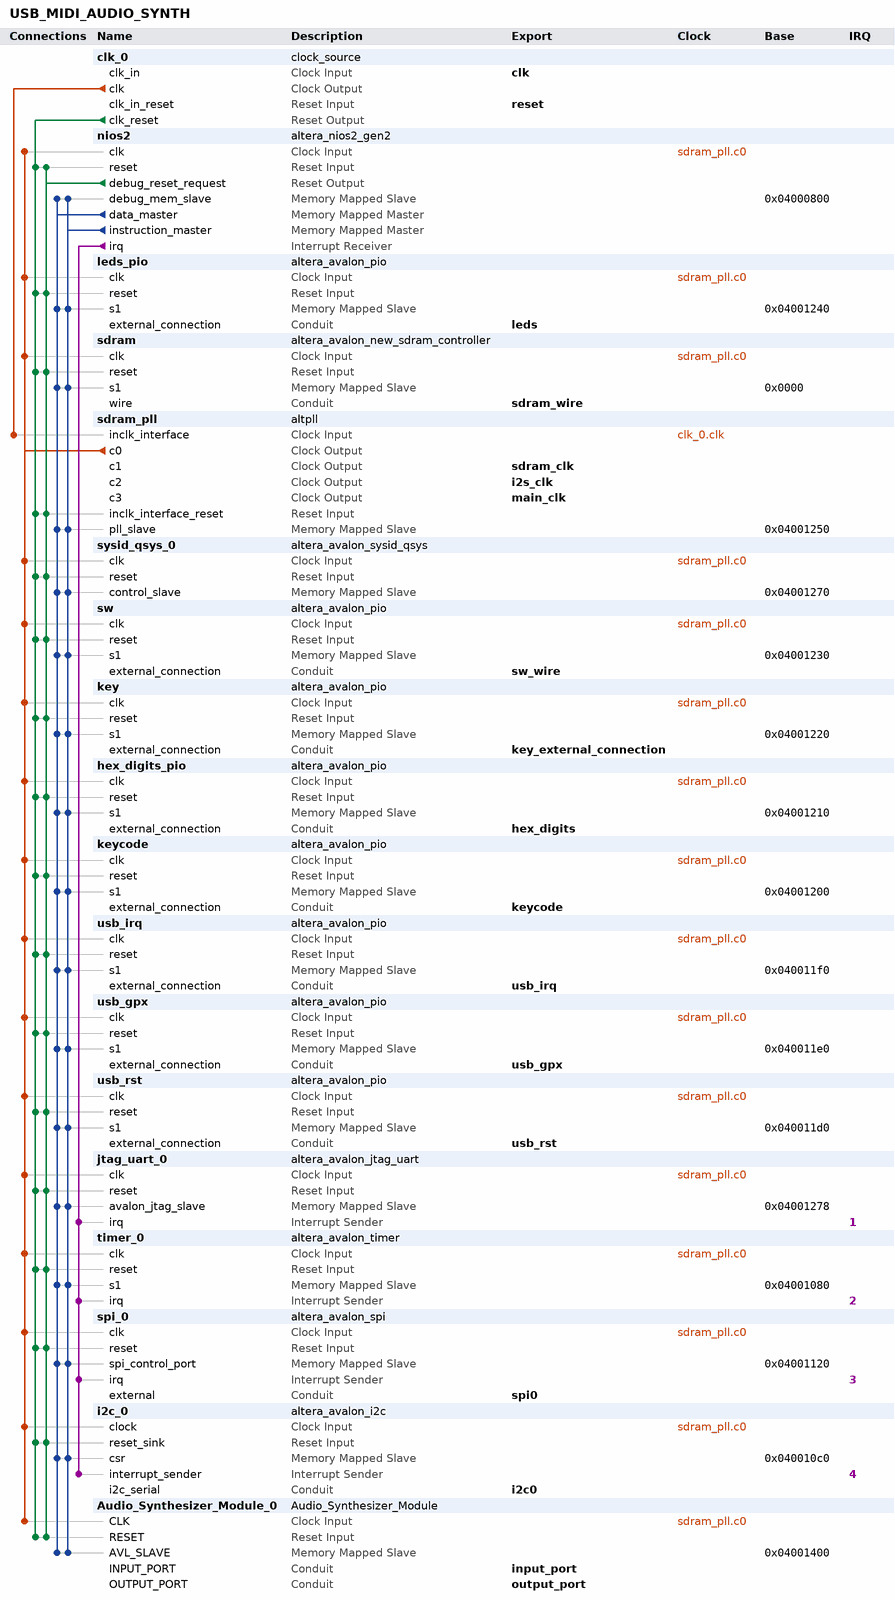
[diagram p0: system contents]
# Platform Designer (Qsys) system USB_MIDI_AUDIO_SYNTH, MAX 10 10M50DAF484C7G
# Parameters at their usual value, and those the tool derives, are not listed.
package require -exact qsys 18.1
create_system USB_MIDI_AUDIO_SYNTH
set_project_property DEVICE_FAMILY {MAX 10}
set_project_property DEVICE 10M50DAF484C7G

add_instance clk_0 clock_source 18.1
set_instance_parameter_value clk_0 clockFrequency 50000000

add_instance nios2 altera_nios2_gen2 18.1
set_instance_parameter_value nios2 dcache_size 2048
set_instance_parameter_value nios2 exceptionSlave sdram.s1
set_instance_parameter_value nios2 icache_size 4096
set_instance_parameter_value nios2 impl Tiny
set_instance_parameter_value nios2 resetSlave sdram.s1

add_instance leds_pio altera_avalon_pio 18.1
set_instance_parameter_value leds_pio direction Output
set_instance_parameter_value leds_pio width 14

add_instance sdram altera_avalon_new_sdram_controller 18.1
set_instance_parameter_value sdram TAC 5.4
set_instance_parameter_value sdram TRCD 20.0
set_instance_parameter_value sdram TRP 20.0
set_instance_parameter_value sdram casLatency 3
set_instance_parameter_value sdram columnWidth 10
set_instance_parameter_value sdram dataWidth 16
set_instance_parameter_value sdram generateSimulationModel false
set_instance_parameter_value sdram model single_Micron_MT48LC4M32B2_7_chip
set_instance_parameter_value sdram numberOfBanks 4
set_instance_parameter_value sdram numberOfChipSelects 1
set_instance_parameter_value sdram powerUpDelay 200.0
set_instance_parameter_value sdram refreshPeriod 15.625
set_instance_parameter_value sdram rowWidth 13

add_instance sdram_pll altpll 18.1
set_instance_parameter_value sdram_pll CLK0_DIVIDE_BY 1
set_instance_parameter_value sdram_pll CLK0_MULTIPLY_BY 2
set_instance_parameter_value sdram_pll CLK1_DIVIDE_BY 1
set_instance_parameter_value sdram_pll CLK1_DUTY_CYCLE 50
set_instance_parameter_value sdram_pll CLK1_MULTIPLY_BY 2
set_instance_parameter_value sdram_pll CLK1_PHASE_SHIFT -1000
set_instance_parameter_value sdram_pll CLK2_DIVIDE_BY 15625
set_instance_parameter_value sdram_pll CLK2_DUTY_CYCLE 50
set_instance_parameter_value sdram_pll CLK2_MULTIPLY_BY 3528
set_instance_parameter_value sdram_pll CLK2_PHASE_SHIFT 0
set_instance_parameter_value sdram_pll CLK3_DIVIDE_BY 1
set_instance_parameter_value sdram_pll CLK3_DUTY_CYCLE 50
set_instance_parameter_value sdram_pll CLK3_MULTIPLY_BY 2
set_instance_parameter_value sdram_pll CLK3_PHASE_SHIFT 0
set_instance_parameter_value sdram_pll INCLK0_INPUT_FREQUENCY 20000
set_instance_parameter_value sdram_pll PORT_ARESET PORT_UNUSED
set_instance_parameter_value sdram_pll PORT_LOCKED PORT_UNUSED
set_instance_parameter_value sdram_pll PORT_clk1 PORT_USED
set_instance_parameter_value sdram_pll PORT_clk2 PORT_USED
set_instance_parameter_value sdram_pll PORT_clk3 PORT_USED

add_instance sysid_qsys_0 altera_avalon_sysid_qsys 18.1
set_instance_parameter_value sysid_qsys_0 id 0

add_instance sw altera_avalon_pio 18.1
set_instance_parameter_value sw direction Input
set_instance_parameter_value sw width 10

add_instance key altera_avalon_pio 18.1
set_instance_parameter_value key direction Input
set_instance_parameter_value key width 4

add_instance hex_digits_pio altera_avalon_pio 18.1
set_instance_parameter_value hex_digits_pio direction Output
set_instance_parameter_value hex_digits_pio width 16

add_instance keycode altera_avalon_pio 18.1
set_instance_parameter_value keycode direction Output
set_instance_parameter_value keycode width 8

add_instance usb_irq altera_avalon_pio 18.1
set_instance_parameter_value usb_irq direction Input
set_instance_parameter_value usb_irq width 1

add_instance usb_gpx altera_avalon_pio 18.1
set_instance_parameter_value usb_gpx direction Input
set_instance_parameter_value usb_gpx width 1

add_instance usb_rst altera_avalon_pio 18.1
set_instance_parameter_value usb_rst direction Output
set_instance_parameter_value usb_rst width 1

add_instance jtag_uart_0 altera_avalon_jtag_uart 18.1
set_instance_parameter_value jtag_uart_0 simInteractiveOptions NO_INTERACTIVE_WINDOWS

add_instance timer_0 altera_avalon_timer 18.1
set_instance_parameter_value timer_0 counterSize 64
set_instance_parameter_value timer_0 period 1
set_instance_parameter_value timer_0 periodUnits MSEC

add_instance spi_0 altera_avalon_spi 18.1
set_instance_parameter_value spi_0 clockPolarity 0
set_instance_parameter_value spi_0 dataWidth 8
set_instance_parameter_value spi_0 masterSPI true
set_instance_parameter_value spi_0 numberOfSlaves 1
set_instance_parameter_value spi_0 targetClockRate 2500000

add_instance i2c_0 altera_avalon_i2c 18.1
set_instance_parameter_value i2c_0 FIFO_DEPTH 4

add_instance Audio_Synthesizer_Module_0 Audio_Synthesizer_Module 1.0

# connections
add_connection clk_0.clk sdram_pll.inclk_interface clock
add_connection sdram_pll.c0 Audio_Synthesizer_Module_0.CLK clock
add_connection sdram_pll.c0 hex_digits_pio.clk clock
add_connection sdram_pll.c0 i2c_0.clock clock
add_connection sdram_pll.c0 jtag_uart_0.clk clock
add_connection sdram_pll.c0 key.clk clock
add_connection sdram_pll.c0 keycode.clk clock
add_connection sdram_pll.c0 leds_pio.clk clock
add_connection sdram_pll.c0 nios2.clk clock
add_connection sdram_pll.c0 sdram.clk clock
add_connection sdram_pll.c0 spi_0.clk clock
add_connection sdram_pll.c0 sw.clk clock
add_connection sdram_pll.c0 sysid_qsys_0.clk clock
add_connection sdram_pll.c0 timer_0.clk clock
add_connection sdram_pll.c0 usb_gpx.clk clock
add_connection sdram_pll.c0 usb_irq.clk clock
add_connection sdram_pll.c0 usb_rst.clk clock
add_connection clk_0.clk_reset Audio_Synthesizer_Module_0.RESET reset
add_connection clk_0.clk_reset hex_digits_pio.reset reset
add_connection clk_0.clk_reset i2c_0.reset_sink reset
add_connection clk_0.clk_reset jtag_uart_0.reset reset
add_connection clk_0.clk_reset key.reset reset
add_connection clk_0.clk_reset keycode.reset reset
add_connection clk_0.clk_reset leds_pio.reset reset
add_connection clk_0.clk_reset nios2.reset reset
add_connection clk_0.clk_reset sdram.reset reset
add_connection clk_0.clk_reset sdram_pll.inclk_interface_reset reset
add_connection clk_0.clk_reset spi_0.reset reset
add_connection clk_0.clk_reset sw.reset reset
add_connection clk_0.clk_reset sysid_qsys_0.reset reset
add_connection clk_0.clk_reset timer_0.reset reset
add_connection clk_0.clk_reset usb_gpx.reset reset
add_connection clk_0.clk_reset usb_irq.reset reset
add_connection clk_0.clk_reset usb_rst.reset reset
add_connection nios2.debug_reset_request Audio_Synthesizer_Module_0.RESET reset
add_connection nios2.debug_reset_request hex_digits_pio.reset reset
add_connection nios2.debug_reset_request i2c_0.reset_sink reset
add_connection nios2.debug_reset_request jtag_uart_0.reset reset
add_connection nios2.debug_reset_request key.reset reset
add_connection nios2.debug_reset_request keycode.reset reset
add_connection nios2.debug_reset_request leds_pio.reset reset
add_connection nios2.debug_reset_request nios2.reset reset
add_connection nios2.debug_reset_request sdram.reset reset
add_connection nios2.debug_reset_request sdram_pll.inclk_interface_reset reset
add_connection nios2.debug_reset_request spi_0.reset reset
add_connection nios2.debug_reset_request sw.reset reset
add_connection nios2.debug_reset_request sysid_qsys_0.reset reset
add_connection nios2.debug_reset_request timer_0.reset reset
add_connection nios2.debug_reset_request usb_gpx.reset reset
add_connection nios2.debug_reset_request usb_irq.reset reset
add_connection nios2.debug_reset_request usb_rst.reset reset
add_connection nios2.data_master Audio_Synthesizer_Module_0.AVL_SLAVE avalon
set_connection_parameter_value nios2.data_master/Audio_Synthesizer_Module_0.AVL_SLAVE baseAddress 0x04001400
add_connection nios2.data_master hex_digits_pio.s1 avalon
set_connection_parameter_value nios2.data_master/hex_digits_pio.s1 baseAddress 0x04001210
add_connection nios2.data_master i2c_0.csr avalon
set_connection_parameter_value nios2.data_master/i2c_0.csr baseAddress 0x040010c0
add_connection nios2.data_master jtag_uart_0.avalon_jtag_slave avalon
set_connection_parameter_value nios2.data_master/jtag_uart_0.avalon_jtag_slave baseAddress 0x04001278
add_connection nios2.data_master key.s1 avalon
set_connection_parameter_value nios2.data_master/key.s1 baseAddress 0x04001220
add_connection nios2.data_master keycode.s1 avalon
set_connection_parameter_value nios2.data_master/keycode.s1 baseAddress 0x04001200
add_connection nios2.data_master leds_pio.s1 avalon
set_connection_parameter_value nios2.data_master/leds_pio.s1 baseAddress 0x04001240
add_connection nios2.data_master nios2.debug_mem_slave avalon
set_connection_parameter_value nios2.data_master/nios2.debug_mem_slave baseAddress 0x04000800
add_connection nios2.data_master sdram.s1 avalon
set_connection_parameter_value nios2.data_master/sdram.s1 baseAddress 0x0000
add_connection nios2.data_master sdram_pll.pll_slave avalon
set_connection_parameter_value nios2.data_master/sdram_pll.pll_slave baseAddress 0x04001250
add_connection nios2.data_master spi_0.spi_control_port avalon
set_connection_parameter_value nios2.data_master/spi_0.spi_control_port baseAddress 0x04001120
add_connection nios2.data_master sw.s1 avalon
set_connection_parameter_value nios2.data_master/sw.s1 baseAddress 0x04001230
add_connection nios2.data_master sysid_qsys_0.control_slave avalon
set_connection_parameter_value nios2.data_master/sysid_qsys_0.control_slave baseAddress 0x04001270
add_connection nios2.data_master timer_0.s1 avalon
set_connection_parameter_value nios2.data_master/timer_0.s1 baseAddress 0x04001080
add_connection nios2.data_master usb_gpx.s1 avalon
set_connection_parameter_value nios2.data_master/usb_gpx.s1 baseAddress 0x040011e0
add_connection nios2.data_master usb_irq.s1 avalon
set_connection_parameter_value nios2.data_master/usb_irq.s1 baseAddress 0x040011f0
add_connection nios2.data_master usb_rst.s1 avalon
set_connection_parameter_value nios2.data_master/usb_rst.s1 baseAddress 0x040011d0
add_connection nios2.instruction_master Audio_Synthesizer_Module_0.AVL_SLAVE avalon
set_connection_parameter_value nios2.instruction_master/Audio_Synthesizer_Module_0.AVL_SLAVE baseAddress 0x04001400
add_connection nios2.instruction_master hex_digits_pio.s1 avalon
set_connection_parameter_value nios2.instruction_master/hex_digits_pio.s1 baseAddress 0x04001210
add_connection nios2.instruction_master i2c_0.csr avalon
set_connection_parameter_value nios2.instruction_master/i2c_0.csr baseAddress 0x040010c0
add_connection nios2.instruction_master jtag_uart_0.avalon_jtag_slave avalon
set_connection_parameter_value nios2.instruction_master/jtag_uart_0.avalon_jtag_slave baseAddress 0x04001278
add_connection nios2.instruction_master key.s1 avalon
set_connection_parameter_value nios2.instruction_master/key.s1 baseAddress 0x04001220
add_connection nios2.instruction_master keycode.s1 avalon
set_connection_parameter_value nios2.instruction_master/keycode.s1 baseAddress 0x04001200
add_connection nios2.instruction_master leds_pio.s1 avalon
set_connection_parameter_value nios2.instruction_master/leds_pio.s1 baseAddress 0x04001240
add_connection nios2.instruction_master nios2.debug_mem_slave avalon
set_connection_parameter_value nios2.instruction_master/nios2.debug_mem_slave baseAddress 0x04000800
add_connection nios2.instruction_master sdram.s1 avalon
set_connection_parameter_value nios2.instruction_master/sdram.s1 baseAddress 0x0000
add_connection nios2.instruction_master sdram_pll.pll_slave avalon
set_connection_parameter_value nios2.instruction_master/sdram_pll.pll_slave baseAddress 0x04001250
add_connection nios2.instruction_master spi_0.spi_control_port avalon
set_connection_parameter_value nios2.instruction_master/spi_0.spi_control_port baseAddress 0x04001120
add_connection nios2.instruction_master sw.s1 avalon
set_connection_parameter_value nios2.instruction_master/sw.s1 baseAddress 0x04001230
add_connection nios2.instruction_master sysid_qsys_0.control_slave avalon
set_connection_parameter_value nios2.instruction_master/sysid_qsys_0.control_slave baseAddress 0x04001270
add_connection nios2.instruction_master timer_0.s1 avalon
set_connection_parameter_value nios2.instruction_master/timer_0.s1 baseAddress 0x04001080
add_connection nios2.instruction_master usb_gpx.s1 avalon
set_connection_parameter_value nios2.instruction_master/usb_gpx.s1 baseAddress 0x040011e0
add_connection nios2.instruction_master usb_irq.s1 avalon
set_connection_parameter_value nios2.instruction_master/usb_irq.s1 baseAddress 0x040011f0
add_connection nios2.instruction_master usb_rst.s1 avalon
set_connection_parameter_value nios2.instruction_master/usb_rst.s1 baseAddress 0x040011d0
add_connection nios2.irq i2c_0.interrupt_sender interrupt
set_connection_parameter_value nios2.irq/i2c_0.interrupt_sender irqNumber 4
add_connection nios2.irq jtag_uart_0.irq interrupt
set_connection_parameter_value nios2.irq/jtag_uart_0.irq irqNumber 1
add_connection nios2.irq spi_0.irq interrupt
set_connection_parameter_value nios2.irq/spi_0.irq irqNumber 3
add_connection nios2.irq timer_0.irq interrupt
set_connection_parameter_value nios2.irq/timer_0.irq irqNumber 2

# exported interfaces
add_interface clk clock sink
set_interface_property clk EXPORT_OF clk_0.clk_in
add_interface hex_digits conduit end
set_interface_property hex_digits EXPORT_OF hex_digits_pio.external_connection
add_interface i2c0 conduit end
set_interface_property i2c0 EXPORT_OF i2c_0.i2c_serial
add_interface i2s_clk clock source
set_interface_property i2s_clk EXPORT_OF sdram_pll.c2
add_interface input_port conduit end
set_interface_property input_port EXPORT_OF Audio_Synthesizer_Module_0.INPUT_PORT
add_interface key_external_connection conduit end
set_interface_property key_external_connection EXPORT_OF key.external_connection
add_interface keycode conduit end
set_interface_property keycode EXPORT_OF keycode.external_connection
add_interface leds conduit end
set_interface_property leds EXPORT_OF leds_pio.external_connection
add_interface main_clk clock source
set_interface_property main_clk EXPORT_OF sdram_pll.c3
add_interface output_port conduit end
set_interface_property output_port EXPORT_OF Audio_Synthesizer_Module_0.OUTPUT_PORT
add_interface reset reset sink
set_interface_property reset EXPORT_OF clk_0.clk_in_reset
add_interface sdram_clk clock source
set_interface_property sdram_clk EXPORT_OF sdram_pll.c1
add_interface sdram_wire conduit end
set_interface_property sdram_wire EXPORT_OF sdram.wire
add_interface spi0 conduit end
set_interface_property spi0 EXPORT_OF spi_0.external
add_interface sw_wire conduit end
set_interface_property sw_wire EXPORT_OF sw.external_connection
add_interface usb_gpx conduit end
set_interface_property usb_gpx EXPORT_OF usb_gpx.external_connection
add_interface usb_irq conduit end
set_interface_property usb_irq EXPORT_OF usb_irq.external_connection
add_interface usb_rst conduit end
set_interface_property usb_rst EXPORT_OF usb_rst.external_connection

set_interconnect_requirement {$system} qsys_mm.clockCrossingAdapter HANDSHAKE
set_interconnect_requirement {$system} qsys_mm.enableEccProtection FALSE
set_interconnect_requirement {$system} qsys_mm.insertDefaultSlave FALSE
set_interconnect_requirement {$system} qsys_mm.maxAdditionalLatency 1

save_system USB_MIDI_AUDIO_SYNTH.qsys
